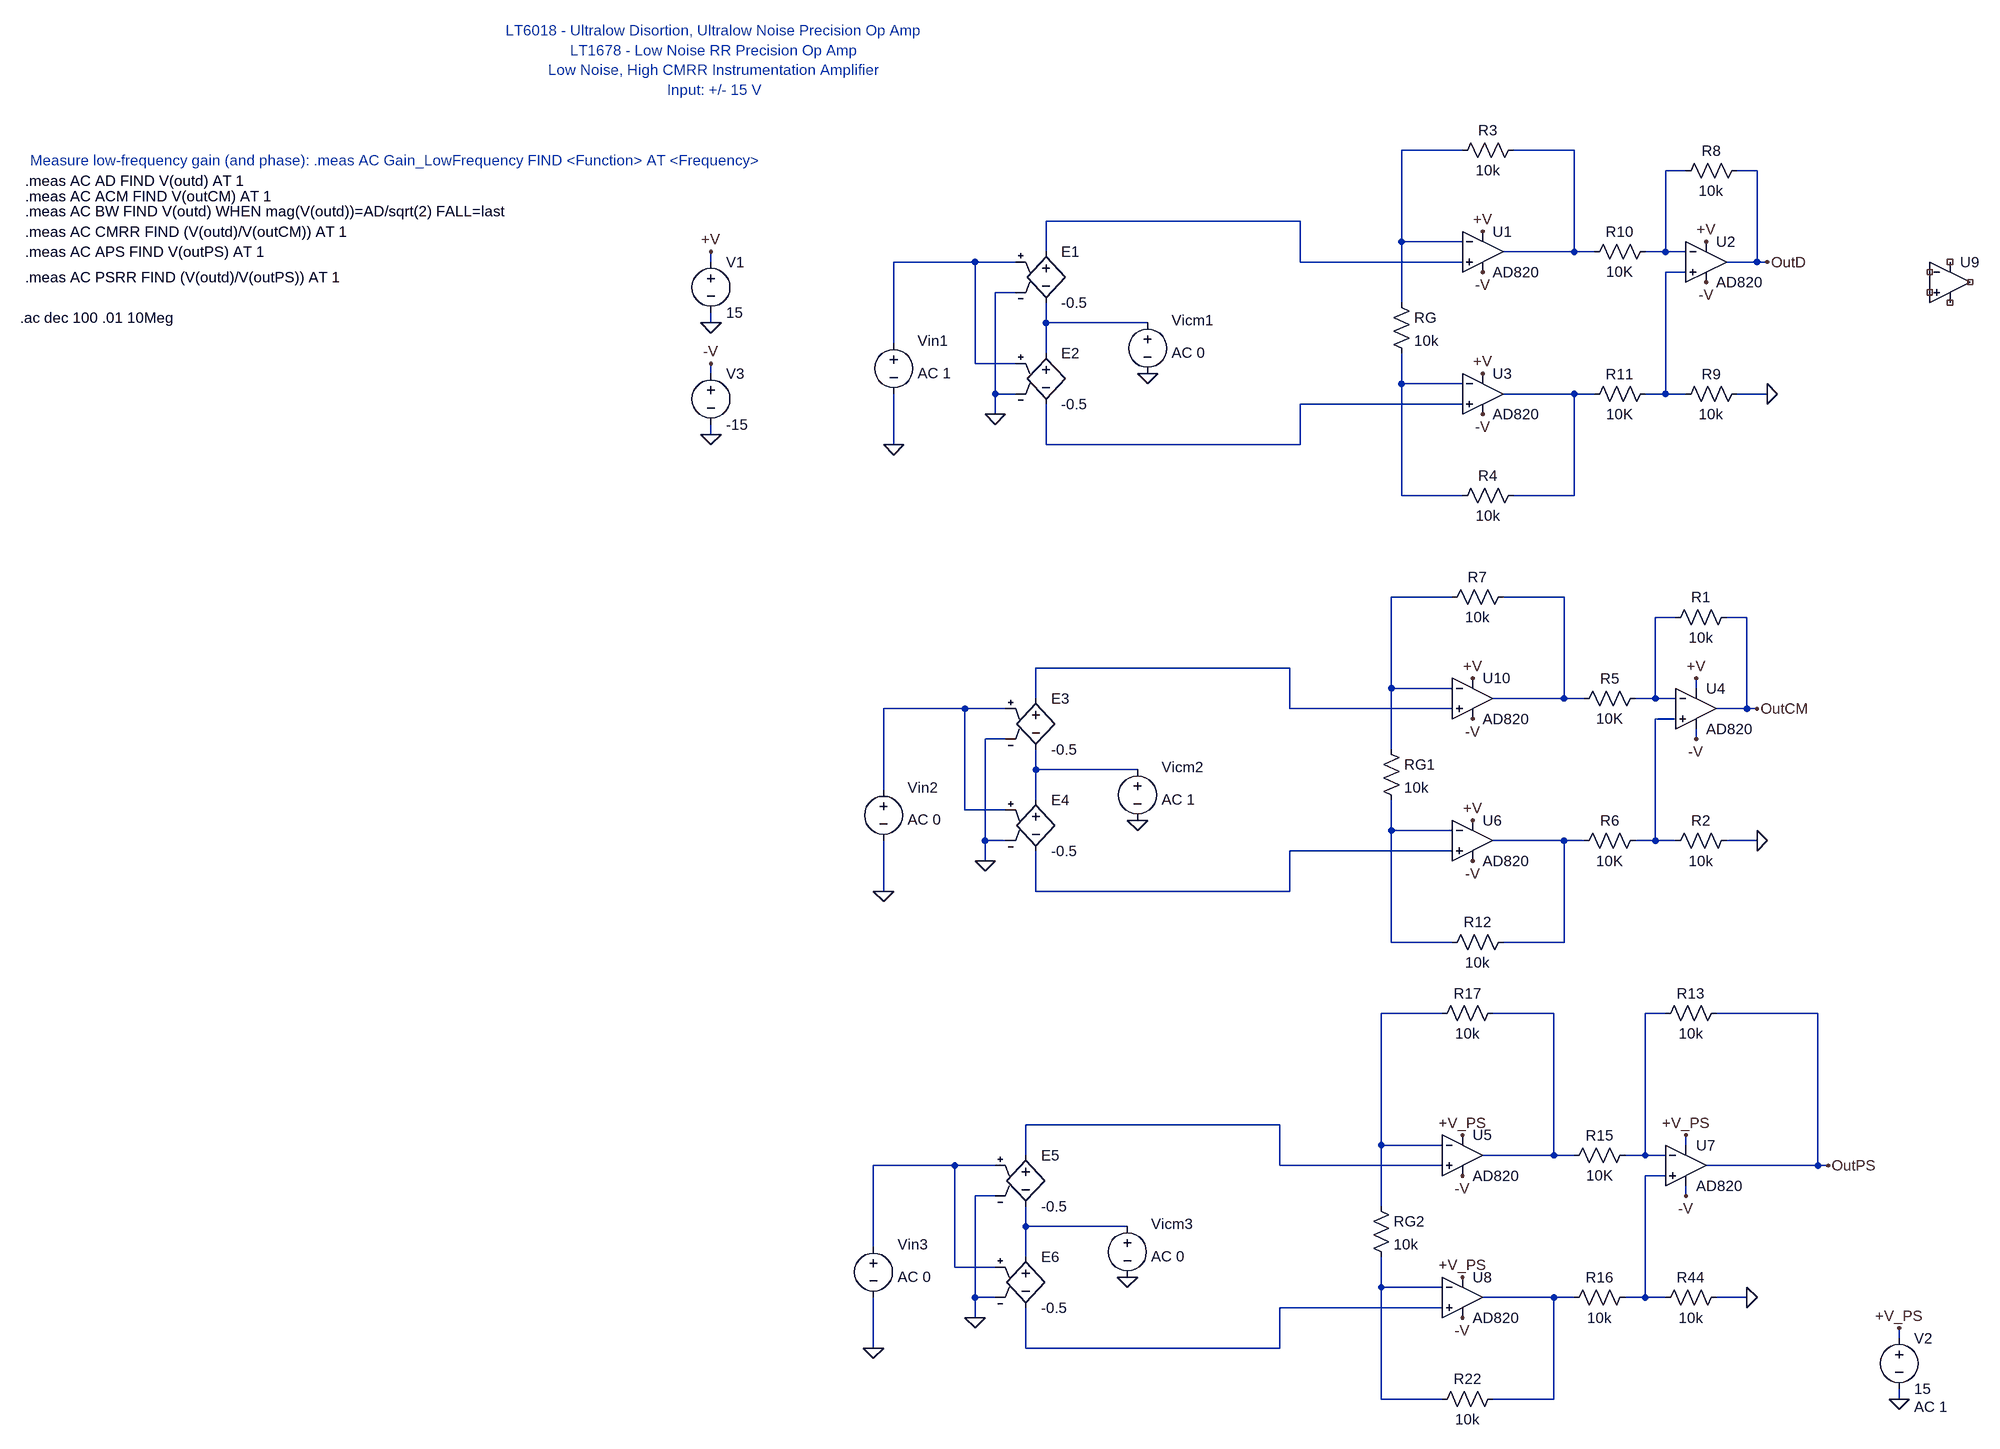
[diagram p0: schematic AI_standard_3AO.asc]
AI_standard_3AO.asc, the LTspice schematic file:
Version 4.1
SHEET 1 2004 2064
WIRE 832 48 736 48
WIRE 1008 48 912 48
WIRE 1184 80 1152 80
WIRE 1296 80 1264 80
WIRE 576 160 176 160
WIRE 736 192 736 48
WIRE 832 192 736 192
WIRE 176 208 176 160
WIRE 1008 208 1008 48
WIRE 1008 208 896 208
WIRE 1040 208 1008 208
WIRE 1152 208 1152 80
WIRE 1152 208 1120 208
WIRE 1184 208 1152 208
WIRE -352 224 -352 208
WIRE 64 224 -64 224
WIRE 128 224 64 224
WIRE 576 224 576 160
WIRE 832 224 576 224
WIRE 1296 224 1296 80
WIRE 1296 224 1248 224
WIRE 1312 224 1296 224
WIRE 1184 240 1152 240
WIRE 128 272 96 272
WIRE 736 288 736 192
WIRE -352 320 -352 304
WIRE 176 320 176 288
WIRE 336 320 176 320
WIRE -64 352 -64 224
WIRE 176 368 176 320
WIRE 64 384 64 224
WIRE 128 384 64 384
WIRE -352 400 -352 384
WIRE 736 416 736 368
WIRE 832 416 736 416
WIRE 96 432 96 272
WIRE 128 432 96 432
WIRE 1008 432 896 432
WIRE 1040 432 1008 432
WIRE 1152 432 1152 240
WIRE 1152 432 1120 432
WIRE 1184 432 1152 432
WIRE 1312 432 1264 432
WIRE 832 448 576 448
WIRE 96 464 96 432
WIRE -352 496 -352 480
WIRE -64 512 -64 432
WIRE 176 512 176 448
WIRE 576 512 576 448
WIRE 576 512 176 512
WIRE 736 592 736 416
WIRE 832 592 736 592
WIRE 1008 592 1008 432
WIRE 1008 592 912 592
WIRE 816 752 720 752
WIRE 992 752 896 752
WIRE 1168 784 1136 784
WIRE 1280 784 1248 784
WIRE 560 864 160 864
WIRE 720 896 720 752
WIRE 816 896 720 896
WIRE 1200 896 1200 880
WIRE 160 912 160 864
WIRE 992 912 992 752
WIRE 992 912 880 912
WIRE 1024 912 992 912
WIRE 1136 912 1136 784
WIRE 1136 912 1104 912
WIRE 1168 912 1136 912
WIRE 48 928 -80 928
WIRE 112 928 48 928
WIRE 560 928 560 864
WIRE 816 928 560 928
WIRE 1280 928 1280 784
WIRE 1280 928 1232 928
WIRE 1296 928 1280 928
WIRE 1168 944 1136 944
WIRE 112 976 80 976
WIRE 1200 976 1200 960
WIRE 720 992 720 896
WIRE 160 1024 160 992
WIRE 320 1024 160 1024
WIRE -80 1056 -80 928
WIRE 160 1072 160 1024
WIRE 48 1088 48 928
WIRE 112 1088 48 1088
WIRE 720 1120 720 1072
WIRE 816 1120 720 1120
WIRE 80 1136 80 976
WIRE 112 1136 80 1136
WIRE 992 1136 880 1136
WIRE 1024 1136 992 1136
WIRE 1136 1136 1136 944
WIRE 1136 1136 1104 1136
WIRE 1168 1136 1136 1136
WIRE 1296 1136 1248 1136
WIRE 816 1152 560 1152
WIRE 80 1168 80 1136
WIRE -80 1216 -80 1136
WIRE 160 1216 160 1152
WIRE 560 1216 560 1152
WIRE 560 1216 160 1216
WIRE 720 1296 720 1120
WIRE 816 1296 720 1296
WIRE 992 1296 992 1136
WIRE 992 1296 896 1296
WIRE 800 1408 704 1408
WIRE 976 1408 880 1408
WIRE 1152 1408 1120 1408
WIRE 1392 1408 1232 1408
WIRE 544 1584 144 1584
WIRE 704 1616 704 1408
WIRE 800 1616 704 1616
WIRE 1184 1616 1184 1600
WIRE 144 1632 144 1584
WIRE 976 1632 976 1408
WIRE 976 1632 864 1632
WIRE 1008 1632 976 1632
WIRE 1120 1632 1120 1408
WIRE 1120 1632 1088 1632
WIRE 1152 1632 1120 1632
WIRE 32 1648 -96 1648
WIRE 96 1648 32 1648
WIRE 544 1648 544 1584
WIRE 800 1648 544 1648
WIRE 1392 1648 1392 1408
WIRE 1392 1648 1216 1648
WIRE 1408 1648 1392 1648
WIRE 1152 1664 1120 1664
WIRE 96 1696 64 1696
WIRE 1184 1696 1184 1680
WIRE 704 1712 704 1616
WIRE 144 1744 144 1712
WIRE 304 1744 144 1744
WIRE -96 1776 -96 1648
WIRE 144 1792 144 1744
WIRE 32 1808 32 1648
WIRE 96 1808 32 1808
WIRE 704 1840 704 1792
WIRE 800 1840 704 1840
WIRE 64 1856 64 1696
WIRE 96 1856 64 1856
WIRE 976 1856 864 1856
WIRE 1008 1856 976 1856
WIRE 1120 1856 1120 1664
WIRE 1120 1856 1088 1856
WIRE 1152 1856 1120 1856
WIRE 1280 1856 1232 1856
WIRE 800 1872 544 1872
WIRE 64 1888 64 1856
WIRE 1520 1920 1520 1904
WIRE -96 1936 -96 1856
WIRE 144 1936 144 1872
WIRE 544 1936 544 1872
WIRE 544 1936 144 1936
WIRE 704 2016 704 1840
WIRE 800 2016 704 2016
WIRE 976 2016 976 1856
WIRE 976 2016 880 2016
WIRE 1520 2016 1520 2000
FLAG -352 320 0
FLAG -352 496 0
FLAG -352 208 +V
FLAG -352 384 -V
FLAG 1312 432 0
FLAG 1312 224 OutD
FLAG -64 512 0
FLAG 96 464 0
FLAG 336 400 0
FLAG 848 880 +V
FLAG 1296 1136 0
FLAG 848 1168 -V
FLAG 1296 928 OutCM
FLAG 1200 880 +V
FLAG 1200 976 -V
FLAG 848 1104 +V
FLAG 848 944 -V
FLAG -80 1216 0
FLAG 80 1168 0
FLAG 320 1104 0
FLAG 1280 1856 0
FLAG 1408 1648 OutPS
FLAG 1184 1696 -V
FLAG -96 1936 0
FLAG 64 1888 0
FLAG 304 1824 0
FLAG 1520 2016 0
FLAG 1520 1904 +V_PS
FLAG 1184 1600 +V_PS
FLAG 832 1664 -V
FLAG 832 1888 -V
FLAG 864 176 +V
FLAG 864 240 -V
FLAG 1216 192 +V
FLAG 1216 256 -V
FLAG 864 400 +V
FLAG 864 464 -V
FLAG 832 1600 +V_PS
FLAG 832 1824 +V_PS
SYMBOL voltage -352 208 R0
WINDOW 123 0 0 Left 2
WINDOW 39 0 0 Left 2
SYMATTR InstName V1
SYMATTR Value 15
SYMBOL voltage -352 384 R0
WINDOW 123 0 0 Left 2
WINDOW 39 0 0 Left 2
SYMATTR InstName V3
SYMATTR Value -15
SYMBOL res 1280 64 R90
WINDOW 0 0 56 VBottom 2
WINDOW 3 32 56 VTop 2
SYMATTR InstName R8
SYMATTR Value 10k
SYMATTR SpiceLine tol=1 pwr=0.1
SYMBOL res 1280 416 R90
WINDOW 0 0 56 VBottom 2
WINDOW 3 32 56 VTop 2
SYMATTR InstName R9
SYMATTR Value 10k
SYMATTR SpiceLine tol=1 pwr=0.1
SYMBOL res 1136 192 R90
WINDOW 0 0 56 VBottom 2
WINDOW 3 32 56 VTop 2
SYMATTR InstName R10
SYMATTR Value 10K
SYMATTR SpiceLine tol=1 pwr=0.1
SYMBOL res 1136 416 R90
WINDOW 0 0 56 VBottom 2
WINDOW 3 32 56 VTop 2
SYMATTR InstName R11
SYMATTR Value 10K
SYMATTR SpiceLine tol=1 pwr=0.1
SYMBOL res 720 272 R0
SYMATTR InstName RG
SYMATTR Value 10k
SYMATTR SpiceLine tol=1 pwr=0.1
SYMBOL res 928 32 R90
WINDOW 0 0 56 VBottom 2
WINDOW 3 32 56 VTop 2
SYMATTR InstName R3
SYMATTR Value 10k
SYMATTR SpiceLine tol=1 pwr=0.1
SYMBOL res 928 576 R90
WINDOW 0 0 56 VBottom 2
WINDOW 3 32 56 VTop 2
SYMATTR InstName R4
SYMATTR Value 10k
SYMATTR SpiceLine tol=1 pwr=0.1
SYMBOL voltage -64 336 R0
WINDOW 123 38 63 Left 2
WINDOW 39 0 0 Left 2
WINDOW 0 38 12 Left 2
WINDOW 3 -188 38 Left 2
SYMATTR Value2 AC 1
SYMATTR InstName Vin1
SYMATTR Value ""
SYMBOL e 176 192 R0
SYMATTR InstName E1
SYMATTR Value -0.5
SYMBOL e 176 352 R0
SYMATTR InstName E2
SYMATTR Value -0.5
SYMBOL voltage 336 304 R0
WINDOW 123 38 63 Left 2
WINDOW 39 0 0 Left 2
WINDOW 0 38 12 Left 2
WINDOW 3 -188 38 Left 2
SYMATTR Value2 AC 0
SYMATTR InstName Vicm1
SYMATTR Value ""
SYMBOL res 1264 768 R90
WINDOW 0 0 56 VBottom 2
WINDOW 3 32 56 VTop 2
SYMATTR InstName R1
SYMATTR Value 10k
SYMATTR SpiceLine tol=1 pwr=0.1
SYMBOL res 1264 1120 R90
WINDOW 0 0 56 VBottom 2
WINDOW 3 32 56 VTop 2
SYMATTR InstName R2
SYMATTR Value 10k
SYMATTR SpiceLine tol=1 pwr=0.1
SYMBOL res 1120 896 R90
WINDOW 0 0 56 VBottom 2
WINDOW 3 32 56 VTop 2
SYMATTR InstName R5
SYMATTR Value 10K
SYMATTR SpiceLine tol=1 pwr=0.1
SYMBOL res 1120 1120 R90
WINDOW 0 0 56 VBottom 2
WINDOW 3 32 56 VTop 2
SYMATTR InstName R6
SYMATTR Value 10K
SYMATTR SpiceLine tol=1 pwr=0.1
SYMBOL res 704 976 R0
SYMATTR InstName RG1
SYMATTR Value 10k
SYMATTR SpiceLine tol=1 pwr=0.1
SYMBOL res 912 736 R90
WINDOW 0 0 56 VBottom 2
WINDOW 3 32 56 VTop 2
SYMATTR InstName R7
SYMATTR Value 10k
SYMATTR SpiceLine tol=1 pwr=0.1
SYMBOL res 912 1280 R90
WINDOW 0 0 56 VBottom 2
WINDOW 3 32 56 VTop 2
SYMATTR InstName R12
SYMATTR Value 10k
SYMATTR SpiceLine tol=1 pwr=0.1
SYMBOL voltage -80 1040 R0
WINDOW 123 38 63 Left 2
WINDOW 39 0 0 Left 2
WINDOW 0 38 12 Left 2
WINDOW 3 -188 38 Left 2
SYMATTR Value2 AC 0
SYMATTR InstName Vin2
SYMATTR Value ""
SYMBOL e 160 896 R0
SYMATTR InstName E3
SYMATTR Value -0.5
SYMBOL e 160 1056 R0
SYMATTR InstName E4
SYMATTR Value -0.5
SYMBOL voltage 320 1008 R0
WINDOW 123 38 63 Left 2
WINDOW 39 0 0 Left 2
WINDOW 0 38 12 Left 2
WINDOW 3 -188 38 Left 2
SYMATTR Value2 AC 1
SYMATTR InstName Vicm2
SYMATTR Value ""
SYMBOL res 1248 1392 R90
WINDOW 0 0 56 VBottom 2
WINDOW 3 32 56 VTop 2
SYMATTR InstName R13
SYMATTR Value 10k
SYMATTR SpiceLine tol=1 pwr=0.1
SYMBOL res 1248 1840 R90
WINDOW 0 0 56 VBottom 2
WINDOW 3 32 56 VTop 2
SYMATTR InstName R44
SYMATTR Value 10k
SYMATTR SpiceLine tol=1 pwr=0.1
SYMBOL res 1104 1616 R90
WINDOW 0 0 56 VBottom 2
WINDOW 3 32 56 VTop 2
SYMATTR InstName R15
SYMATTR Value 10K
SYMATTR SpiceLine tol=1 pwr=0.1
SYMBOL res 1104 1840 R90
WINDOW 0 0 56 VBottom 2
WINDOW 3 32 56 VTop 2
SYMATTR InstName R16
SYMATTR Value 10k
SYMATTR SpiceLine tol=1 pwr=0.1
SYMBOL res 688 1696 R0
SYMATTR InstName RG2
SYMATTR Value 10k
SYMATTR SpiceLine tol=1 pwr=0.1
SYMBOL res 896 1392 R90
WINDOW 0 0 56 VBottom 2
WINDOW 3 32 56 VTop 2
SYMATTR InstName R17
SYMATTR Value 10k
SYMATTR SpiceLine tol=1 pwr=0.1
SYMBOL res 896 2000 R90
WINDOW 0 0 56 VBottom 2
WINDOW 3 32 56 VTop 2
SYMATTR InstName R22
SYMATTR Value 10k
SYMATTR SpiceLine tol=1 pwr=0.1
SYMBOL voltage -96 1760 R0
WINDOW 123 38 63 Left 2
WINDOW 39 0 0 Left 2
WINDOW 0 38 12 Left 2
WINDOW 3 -188 38 Left 2
SYMATTR Value2 AC 0
SYMATTR InstName Vin3
SYMATTR Value ""
SYMBOL e 144 1616 R0
SYMATTR InstName E5
SYMATTR Value -0.5
SYMBOL e 144 1776 R0
SYMATTR InstName E6
SYMATTR Value -0.5
SYMBOL voltage 304 1728 R0
WINDOW 123 38 63 Left 2
WINDOW 39 0 0 Left 2
WINDOW 0 38 12 Left 2
WINDOW 3 -188 38 Left 2
SYMATTR Value2 AC 0
SYMATTR InstName Vicm3
SYMATTR Value ""
SYMBOL voltage 1520 1904 R0
WINDOW 123 24 124 Left 2
WINDOW 39 0 0 Left 2
SYMATTR Value2 AC 1
SYMATTR InstName V2
SYMATTR Value 15
SYMBOL OpAmps\\AD820 848 848 R0
SYMATTR InstName U10
SYMBOL OpAmps\\AD820 1200 864 R0
SYMATTR InstName U4
SYMBOL OpAmps\\AD820 848 1072 R0
SYMATTR InstName U6
SYMBOL OpAmps\\AD820 832 1568 R0
SYMATTR InstName U5
SYMBOL OpAmps\\AD820 1184 1584 R0
SYMATTR InstName U7
SYMBOL OpAmps\\AD820 832 1792 R0
SYMATTR InstName U8
SYMBOL OpAmps\\AD820 864 144 R0
SYMATTR InstName U1
SYMBOL OpAmps\\AD820 1216 160 R0
SYMATTR InstName U2
SYMBOL OpAmps\\AD820 864 368 R0
SYMATTR InstName U3
SYMBOL OpAmps\\UniversalOpAmp2 1600 256 R0
SYMATTR InstName U9
TEXT -344 -32 Bottom 2 ;LT6018 - Ultralow Disortion, Ultralow Noise Precision Op Amp\nLT1678 - Low Noise RR Precision Op Amp\nLow Noise, High CMRR Instrumentation Amplifier\nInput: +/- 15 V
TEXT -1440 312 Left 2 !.ac dec 100 .01 10Meg
TEXT -1432 96 Left 2 !.meas AC AD FIND V(outd) AT 1
TEXT -1424 64 Left 2 ;Measure low-frequency gain (and phase): .meas AC Gain_LowFrequency FIND <Function> AT <Frequency>
TEXT -1432 120 Left 2 !.meas AC ACM FIND V(outCM) AT 1
TEXT -1432 144 Left 2 !.meas AC BW FIND V(outd) WHEN mag(V(outd))=AD/sqrt(2) FALL=last
TEXT -1432 176 Left 2 !.meas AC CMRR FIND (V(outd)/V(outCM)) AT 1
TEXT -1432 248 Left 2 !.meas AC PSRR FIND (V(outd)/V(outPS)) AT 1
TEXT -1432 208 Left 2 !.meas AC APS FIND V(outPS) AT 1

The netlist it stands for:
* AI_standard_3AO.asc
V1 +V 0 15
V3 -V 0 -15
R8 OutD N003 10k tol=1 pwr=0.1
R9 0 N006 10k tol=1 pwr=0.1
R10 N003 N002 10K tol=1 pwr=0.1
R11 N006 N009 10K tol=1 pwr=0.1
RG N001 N008 10k tol=1 pwr=0.1
R3 N002 N001 10k tol=1 pwr=0.1
R4 N009 N008 10k tol=1 pwr=0.1
Vin1 N005 0 AC 1
E1 N004 N007 N005 0 -0.5
E2 N007 N010 N005 0 -0.5
Vicm1 N007 0 AC 0
R1 OutCM N013 10k tol=1 pwr=0.1
R2 0 N016 10k tol=1 pwr=0.1
R5 N013 N012 10K tol=1 pwr=0.1
R6 N016 N019 10K tol=1 pwr=0.1
RG1 N011 N018 10k tol=1 pwr=0.1
R7 N012 N011 10k tol=1 pwr=0.1
R12 N019 N018 10k tol=1 pwr=0.1
Vin2 N015 0 AC 0
E3 N014 N017 N015 0 -0.5
E4 N017 N020 N015 0 -0.5
Vicm2 N017 0 AC 1
R13 OutPS N023 10k tol=1 pwr=0.1
R44 0 N026 10k tol=1 pwr=0.1
R15 N023 N022 10K tol=1 pwr=0.1
R16 N026 N029 10k tol=1 pwr=0.1
RG2 N021 N028 10k tol=1 pwr=0.1
R17 N022 N021 10k tol=1 pwr=0.1
R22 N029 N028 10k tol=1 pwr=0.1
Vin3 N025 0 AC 0
E5 N024 N027 N025 0 -0.5
E6 N027 N030 N025 0 -0.5
Vicm3 N027 0 AC 0
V2 +V_PS 0 15 AC 1
X§U10 N014 N011 +V -V N012 AD820  ; pins In+ In- V+ V- OUT
X§U4 N016 N013 +V -V OutCM AD820  ; pins In+ In- V+ V- OUT
X§U6 N020 N018 +V -V N019 AD820  ; pins In+ In- V+ V- OUT
X§U5 N024 N021 +V_PS -V N022 AD820  ; pins In+ In- V+ V- OUT
X§U7 N026 N023 +V_PS -V OutPS AD820  ; pins In+ In- V+ V- OUT
X§U8 N030 N028 +V_PS -V N029 AD820  ; pins In+ In- V+ V- OUT
X§U1 N004 N001 +V -V N002 AD820  ; pins In+ In- V+ V- OUT
X§U2 N006 N003 +V -V OutD AD820  ; pins In+ In- V+ V- OUT
X§U3 N010 N008 +V -V N009 AD820  ; pins In+ In- V+ V- OUT
X§U9 NC_01 NC_02 NC_03 NC_04 NC_05 level2 Avol=1Meg GBW=10Meg Slew=10Meg Ilimit=25m Rail=0 Vos=0 En=0 Enk=0 In=0 Ink=0 Rin=500Meg  ; pins In+ In- V+ V- OUT
* LT6018 - Ultralow Disortion, Ultralow Noise Precision Op Amp
* LT1678 - Low Noise RR Precision Op Amp
* Low Noise, High CMRR Instrumentation Amplifier
* Input: +/- 15 V
.ac dec 100 .01 10Meg
.meas AC AD FIND V(outd) AT 1
* Measure low-frequency gain (and phase): .meas AC Gain_LowFrequency FIND <Function> AT <Frequency>
.meas AC ACM FIND V(outCM) AT 1
.meas AC BW FIND V(outd) WHEN mag(V(outd))=AD/sqrt(2) FALL=last
.meas AC CMRR FIND (V(outd)/V(outCM)) AT 1
.meas AC PSRR FIND (V(outd)/V(outPS)) AT 1
.meas AC APS FIND V(outPS) AT 1
.lib UniversalOpAmp2.lib
.backanno
.end